# Altium schematic sheet FOC_STM32G431.SchDoc
size A4; SheetNumber: 2; SheetTotal: 2
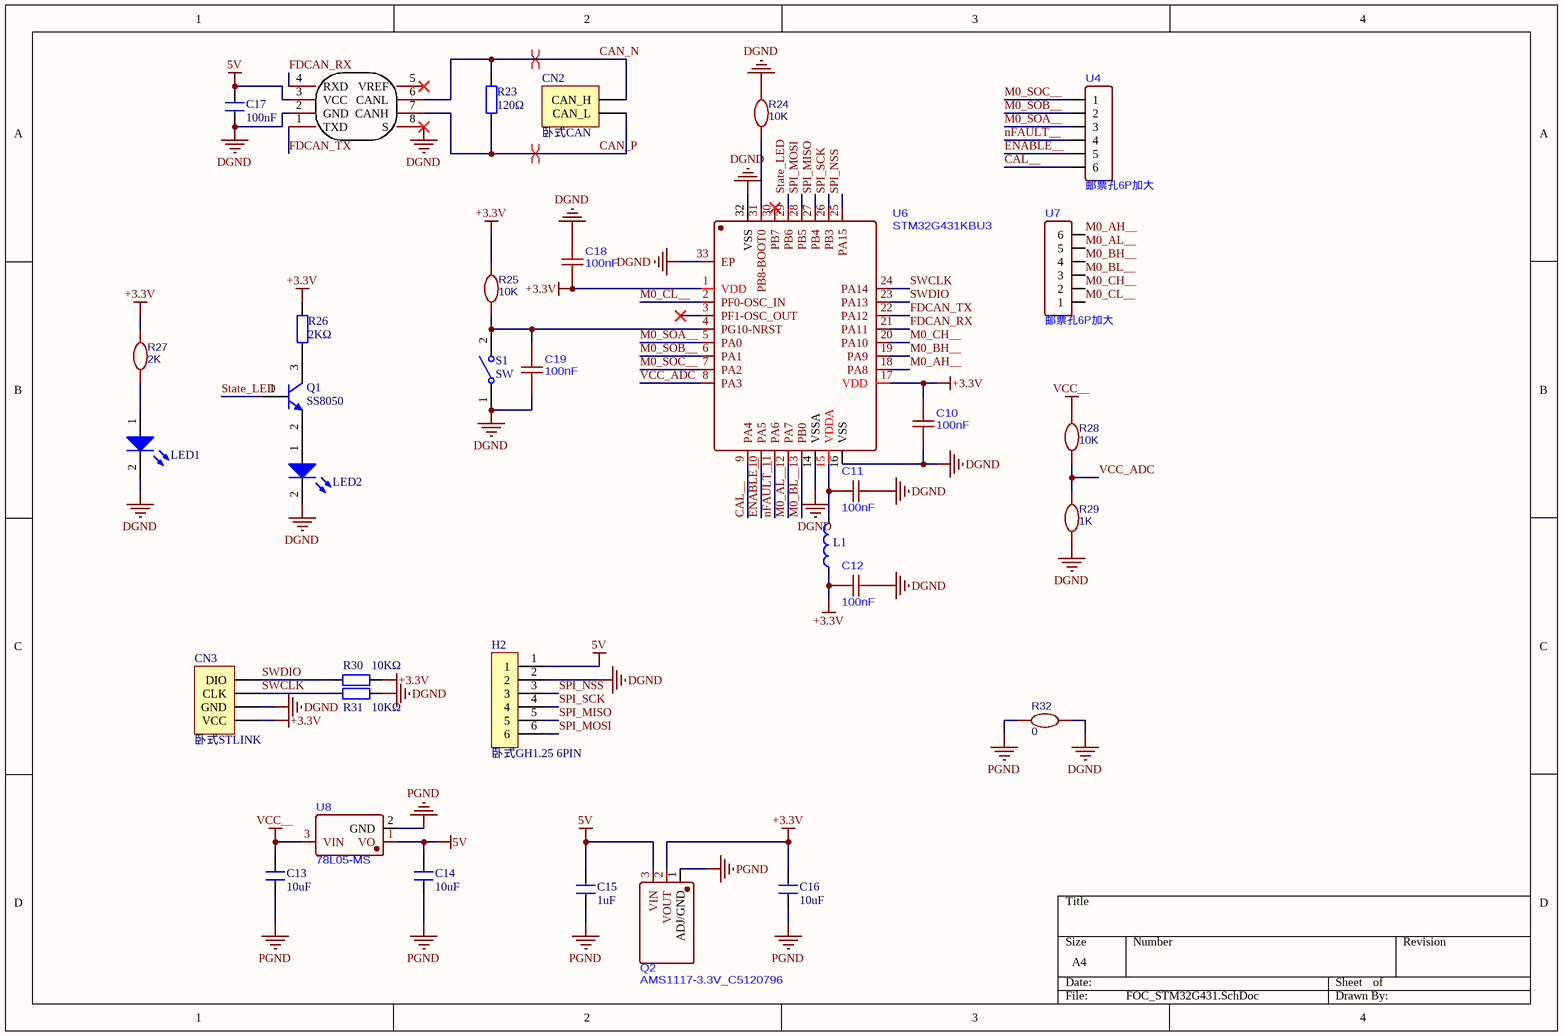
[diagram p0: FOC_STM32G431.SchDoc]

## Parts
C10  100nF  [c0402]
C11  100nF  [c0402]
C12  100nF  [c0402]
C13  10uF  [1210]
C14  10uF  [1210]
C15  1uF  [c0402]
C16  10uF  [1210]
C17  100nF  [c0402]
C18  100nF  [c0402]
C19  100nF  [c0402]
CN2  卧式CAN  [GH1.25 2P 卧式]
CN3  卧式STLINK  [CONN-SMD_4P-P1.25_GH1.25-4P]
H2  卧式GH1.25 6PIN  [CONN-SMD_6P-P1.25_XYECONN_XY-GH1.25-6A61]
L1  1008屏蔽电感  [R0603]  (value not drawn)
LED1  LED  [led0805]  (value not drawn)
LED2  LED  [led0805]  (value not drawn)
Q1  SS8050  [SOT-23-3_L2.9-W1.3-P1.90-LS2.4-BR]
Q2  AMS1117-3.3V_C5120796  [SOT-89-3_L4.5-W2.5-P1.50-LS4.2-BR]
R23  120Ω  [R0402]
R24  10K  [R0402]
R25  10K  [R0402]
R26  2KΩ  [R0402]
R27  2K  [R0402]
R28  10K  [R0402]
R29  1K  [R0402]
R30  10KΩ  [R0402]
R31  10KΩ  [R0402]
R32  0  [R0402]
S1  SW  [KEY_SMD]
U4  邮票孔6P加大  [PCBComponent_1 - duplicate]
U5  SN65HVD1050DR  [SOIC-8_L4.9-W3.9-P1.27-LS6.0-BL]  (value not drawn)
U6  STM32G431KBU3  [UFQFPN-32_L5.0-W5.0-P0.50-BL-EP3.5]
U7  邮票孔6P加大  [PCBComponent_1 - duplicate]
U8  78L05-MS  [SOT-89-3_L4.5-W2.5-P1.50-LS4.2-BR]

## Nets
5V: C14.2 C15.2 C17.2 H2.1 Q2.3(VIN) U5.3(VCC) U8.1(VO)
+3.3V: C10.2 C12.2 C16.2 C18.2 CN3.1(VCC) L1.1 Q2.2(VOUT) R25.1 R26.2 R27.1 R30.1 U6.1(VDD) U6.17(VDD)
DGND: C10.1 C11.1 C12.1 C17.1 C18.1 C19.1 CN3.2(GND) H2.2 LED1.2(K) LED2.2(K) R24.1 R29.1 R31.2 R32.2 S1.1(COMMON) U5.2(GND) U5.8(S) U6.14(VSSA) U6.16(VSS) U6.32(VSS) U6.33(EP)
PGND: C13.1 C14.1 C15.1 C16.1 Q2.1(ADJ/GND) R32.1 U8.2(GND)
VCC__: C13.2 R28.2 U8.3(VIN)
CAL__: U4.1(6) U6.9(PA4)
CAN_N: CN2.1(CAN_H) R23.2 U5.6(CANL)
CAN_P: CN2.2(CAN_L) R23.1 U5.7(CANH)
ENABLE__: U4.2(5) U6.10(PA5)
FDCAN_RX: U5.4(RXD) U6.21(PA11)
FDCAN_TX: U5.1(TXD) U6.22(PA12)
M0_AH__: U6.18(PA8) U7.1(6)
M0_AL__: U6.12(PA7) U7.2(5)
M0_BH__: U6.19(PA9) U7.3(4)
M0_BL__: U6.13(PB0) U7.4(3)
M0_CH__: U6.20(PA10) U7.5(2)
M0_CL__: U6.2(PF0-OSC_IN) U7.6(1)
M0_SOA__: U4.4(3) U6.5(PA0)
M0_SOB__: U4.5(2) U6.6(PA1)
M0_SOC__: U4.6(1) U6.7(PA2)
nFAULT__: U4.3(4) U6.11(PA6)
SPI_MISO: H2.5 U6.27(PB4)
SPI_MOSI: H2.6 U6.28(PB5)
SPI_NSS: H2.3 U6.25(PA15)
SPI_SCK: H2.4 U6.26(PB3)
State_LED: Q1.1(B) U6.29(PB6)
SWCLK: CN3.3(CLK) R31.1 U6.24(PA14)
SWDIO: CN3.4(DIO) R30.2 U6.23(PA13)
VCC_ADC: R28.1 R29.2 U6.8(PA3)
NetC11_2: C11.2 L1.2 U6.15(VDDA)
NetC19_2: C19.2 R25.2 S1.2(NO) U6.4(PG10-NRST)
NetLED1_1: LED1.1(A) R27.2
NetLED2_1: LED2.1(A) Q1.2(E)
NetQ1_3: Q1.3(C) R26.1
NetR24_2: R24.2 U6.31(PB8-BOOT0)

Not connected (* = marked no-connect by the designer): U5 5(VREF)*; U6 3(PF1-OSC_OUT)* 30(PB7)*

## Layout directives
differential pair: CAN_N, CAN_P

## Library data of the parts
C10-C12 C18 C19 = CC0201JRX7R9BB101
C13 C14 C16 = 1210贴片电容
C15 C17 = 0402贴片电容: 贴片电容0402
LED1 LED2 = 0805贴片LED
Q1 = 2N2222: 三极管
R23 R26 R30 R31 = 0402贴片电阻: W: *
R24 R25 R27-R29 R32 = 2.2R: BOM_Manufacturer Part: 0603WAJ022JT5E; BOM_Manufacturer: UniOhm; nameAlias: Value(Ω); spicePre: R; spiceSymbolName: Res_0603(1/10W)_EU; BOM_Supplier: LCSC; BOM_Supplier Part: C25226
S1 = SW: 开关
U5 = SN65HVD1050DR: CAN芯片; Manufacturer: TI(德州仪器); Add into BOM: yes; Supply Voltage: 4.5V~5.5V; Supply Current: 50mA; Name: SN65HVD1050DR; Symbol: SN65HVD1050DR; Device: SN65HVD1050DR; LCSC Part Name: 4.5V~5.5V; Supplier Part: C14019; Manufacturer Part: SN65HVD1050DR; Supplier Footprint: SOIC-8; JLCPCB Part Class: Extended Part; Datasheet: https://www.ti.com/cn/lit/gpn/sn65hvd1050; Supplier: LCSC; Convert to PCB: yes; Type: 收发器; Operating Temperature: -40℃~+125℃
CN2 = 卧式CAN: LatestRevisionDate: 17-Jul-2002; LatestRevisionNote: Re-released for DXP Platform.; Publisher: Altium Limited